# Altium project LEDKEY.PrjPCB
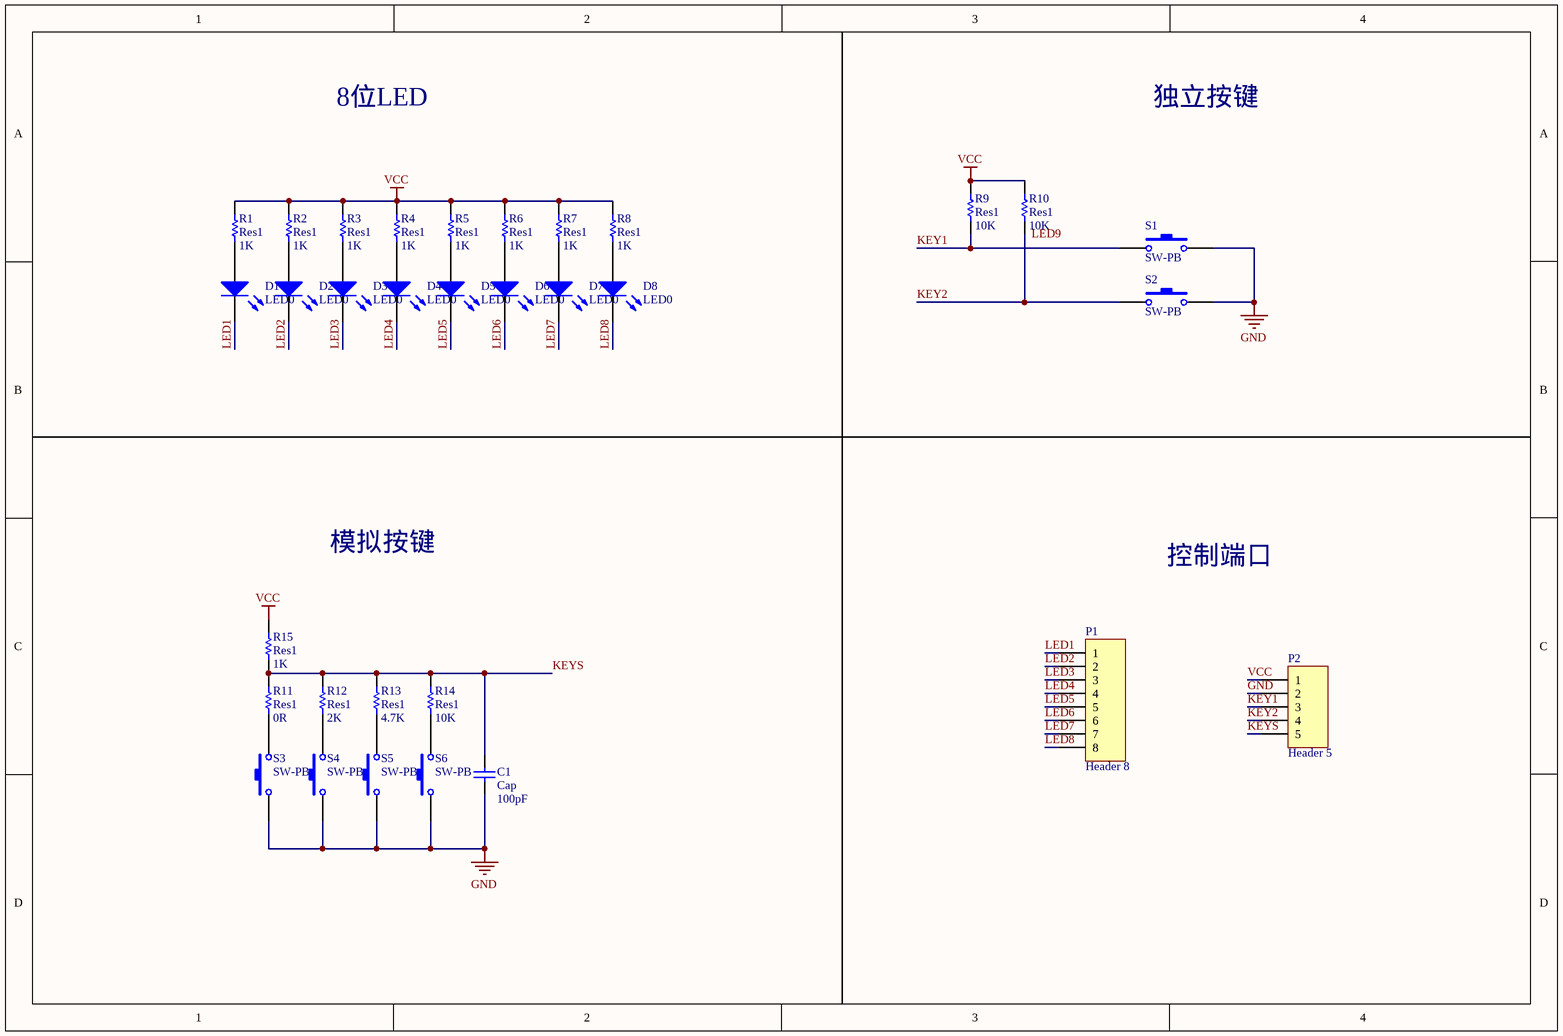
[diagram p0: LEDKEY.SchDoc]
1 sheet, 32 parts. Net scope: global (net labels, ports and power ports of the same name join across sheets).
Board file: LEDKEY.PcbDoc

## Sheet LEDKEY.SchDoc
size A4

### Parts
C1  Cap  value 100pF  [C0603]
D1  LED0  [LED0603]
D2  LED0  [LED0603]
D3  LED0  [LED0603]
D4  LED0  [LED0603]
D5  LED0  [LED0603]
D6  LED0  [LED0603]
D7  LED0  [LED0603]
D8  LED0  [LED0603]
P1  Header 8  [HDR1X8]
P2  Header 5  [HDR1X5]
R1  Res1  value 1K  [R0603]
R2  Res1  value 1K  [R0603]
R3  Res1  value 1K  [R0603]
R4  Res1  value 1K  [R0603]
R5  Res1  value 1K  [R0603]
R6  Res1  value 1K  [R0603]
R7  Res1  value 1K  [R0603]
R8  Res1  value 1K  [R0603]
R9  Res1  value 10K  [R0603]
R10  Res1  value 10K  [R0603]
R11  Res1  value 0R  [R0603]
R12  Res1  value 2K  [R0603]
R13  Res1  value 4.7K  [R0603]
R14  Res1  value 10K  [R0603]
R15  Res1  value 1K  [R0603]
S1  SW-PB  [SW-PB]
S2  SW-PB  [SW-PB]
S3  SW-PB  [SW-PB]
S4  SW-PB  [SW-PB]
S5  SW-PB  [SW-PB]
S6  SW-PB  [SW-PB]

### Nets
GND: C1.1 P2.2 S1.2 S2.2 S3.1 S4.1 S5.1 S6.1
VCC: P2.1 R1.2 R2.2 R3.2 R4.2 R5.2 R6.2 R7.2 R8.2 R9.2 R10.2 R15.2
KEY1: P2.3 R9.1 S1.1
KEY2: P2.4 R10.1 S2.1
KEYS: C1.2 P2.5 R11.2 R12.2 R13.2 R14.2 R15.1
LED1: D1.1(K) P1.1
LED2: D2.1(K) P1.2
LED3: D3.1(K) P1.3
LED4: D4.1(K) P1.4
LED5: D5.1(K) P1.5
LED6: D6.1(K) P1.6
LED7: D7.1(K) P1.7
LED8: D8.1(K) P1.8
NetD1_2: D1.2(A) R1.1
NetD2_2: D2.2(A) R2.1
NetD3_2: D3.2(A) R3.1
NetD4_2: D4.2(A) R4.1
NetD5_2: D5.2(A) R5.1
NetD6_2: D6.2(A) R6.1
NetD7_2: D7.2(A) R7.1
NetD8_2: D8.2(A) R8.1
NetR11_1: R11.1 S3.2
NetR12_1: R12.1 S4.2
NetR13_1: R13.1 S5.2
NetR14_1: R14.1 S6.2

### Notes on the sheet
- 8位LED
- 独立按键
- 模拟按键
- 控制端口
- Labels drawn without touching a wire or pin: LED9

### Library data of the parts
C1 = Cap: Capacitor; Published: 8-Jun-2000; LatestRevisionDate: 17-Jul-2002; LatestRevisionNote: Re-released for DXP Platform.; PackageReference: RAD-0.3; Publisher: Altium Limited; PackageDescription: Radial Cap, Thru-Hole; 2 Leads; 0.3 in Pin Spacing
D1-D8 = LED: Typical INFRARED GaAs LED; Published: 8-Jun-2000; LatestRevisionDate: 08-Jul-2005; LatestRevisionNote: Mech Layer 1 removed.; PackageReference: LED-0; Publisher: Altium Limited; PackageDescription: LED; 2 Leads
P1 = Header 8: Header, 8-Pin; LatestRevisionDate: 17-Jul-2002; LatestRevisionNote: Re-released for DXP Platform.; Publisher: Altium Limited
P2 = Header 5: Header, 5-Pin; LatestRevisionDate: 17-Jul-2002; LatestRevisionNote: Re-released for DXP Platform.; Publisher: Altium Limited
R1-R15 = Res: Resistor; Published: 8-Jun-2000; LatestRevisionDate: 17-Jul-2002; LatestRevisionNote: Re-released for DXP Platform.; PackageReference: AXIAL-0.3; Publisher: Altium Limited; PackageDescription: Axial Device, Thru-Hole; 2 Leads; 0.3 in Pin Spacing
S1-S6 = SW-PB: Switch; Published: 24-Mar-1999; LatestRevisionDate: 17-Jul-2002; LatestRevisionNote: Re-released for DXP Platform.; PackageReference: SPST-2; Publisher: Altium Limited; PackageDescription: Switch; 2 Leads